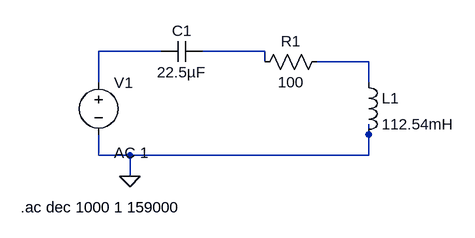
[diagram p0: schematic alta.asc]
alta.asc, the LTspice schematic file:
Version 4.1
SHEET 1 880 680
WIRE -192 -48 -288 -48
WIRE -32 -48 -128 -48
WIRE -32 -32 -32 -48
WIRE 128 -32 48 -32
WIRE -288 0 -288 -48
WIRE 128 0 128 -32
WIRE 128 80 128 64
WIRE -288 112 -288 80
WIRE -240 112 -288 112
WIRE 128 112 128 80
WIRE 128 112 -240 112
WIRE -240 144 -240 112
FLAG -240 144 0
SYMBOL voltage -288 -16 R0
WINDOW 123 24 124 Left 2
WINDOW 39 0 0 Left 0
SYMATTR Value2 AC 1
SYMATTR InstName V1
SYMATTR Value ""
SYMBOL res 64 -48 R90
WINDOW 0 0 56 VBottom 2
WINDOW 3 32 56 VTop 2
SYMATTR InstName R1
SYMATTR Value 100
SYMBOL ind 112 -16 R0
SYMATTR InstName L1
SYMATTR Value 112.54mH
SYMBOL cap -128 -64 R90
WINDOW 0 0 32 VBottom 2
WINDOW 3 32 32 VTop 2
SYMATTR InstName C1
SYMATTR Value 22.5µF
TEXT -408 192 Left 2 !.ac dec 1000 1 159000

The netlist it stands for:
* alta.asc
V1 N001 0 AC 1
R1 N003 N002 100
L1 N003 0 112.54mH
C1 N002 N001 22.5µF
.ac dec 1000 1 159000
.backanno
.end